# Altium project PCB_Project_PowerLord.PrjPcb
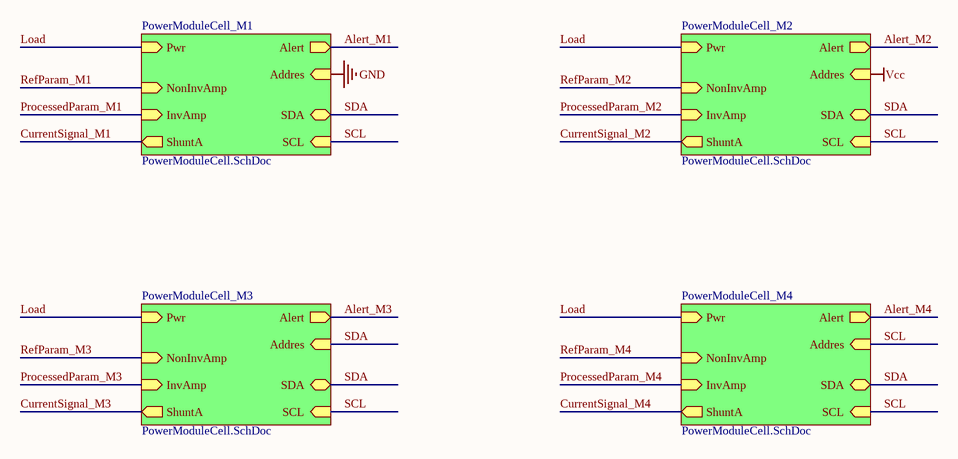
[diagram p0: PowerModule.SchDoc]
5 sheets, 64 parts. Net scope: hierarchical (ports join the sheet entries above them; power ports are global).
Board file: PowerModule.PcbDoc
Sheets:
  PowerModule.SchDoc
    PowerModuleCell_M1 = PowerModuleCell.SchDoc
    PowerModuleCell_M3 = PowerModuleCell.SchDoc
    PowerModuleCell_M2 = PowerModuleCell.SchDoc
    PowerModuleCell_M4 = PowerModuleCell.SchDoc
  MainBoard.SchDoc
    Voltmetr = AutoRange.SchDoc
  UI.SchDoc

## Sheet PowerModule.SchDoc
size A3; SheetNumber: 4; SheetTotal: 10

### Sub-sheets
PowerModuleCell_M1 = PowerModuleCell.SchDoc: Alert (out), Addres (in), SDA (bidir), SCL (in), Pwr (in), NonInvAmp (in), InvAmp (in), ShuntA (out)
PowerModuleCell_M2 = PowerModuleCell.SchDoc: Alert (out), Addres (in), SDA (bidir), SCL (in), Pwr (in), NonInvAmp (in), InvAmp (in), ShuntA (out)
PowerModuleCell_M3 = PowerModuleCell.SchDoc: Alert (out), Addres (in), SDA (bidir), SCL (in), Pwr (in), NonInvAmp (in), InvAmp (in), ShuntA (out)
PowerModuleCell_M4 = PowerModuleCell.SchDoc: Alert (out), Addres (in), SDA (bidir), SCL (in), Pwr (in), NonInvAmp (in), InvAmp (in), ShuntA (out)

### Nets
Alert_M1: sheet PowerModuleCell_M1/Alert
Alert_M2: sheet PowerModuleCell_M2/Alert
Alert_M3: sheet PowerModuleCell_M3/Alert
Alert_M4: sheet PowerModuleCell_M4/Alert
CurrentSignal_M1: sheet PowerModuleCell_M1/ShuntA
CurrentSignal_M2: sheet PowerModuleCell_M2/ShuntA
CurrentSignal_M3: sheet PowerModuleCell_M3/ShuntA
CurrentSignal_M4: sheet PowerModuleCell_M4/ShuntA
Load: sheet PowerModuleCell_M1/Pwr, sheet PowerModuleCell_M3/Pwr, sheet PowerModuleCell_M2/Pwr, sheet PowerModuleCell_M4/Pwr
SCL: sheet PowerModuleCell_M1/SCL, sheet PowerModuleCell_M3/SCL, sheet PowerModuleCell_M2/SCL, sheet PowerModuleCell_M4/Addres, sheet PowerModuleCell_M4/SCL
SDA: sheet PowerModuleCell_M1/SDA, sheet PowerModuleCell_M3/Addres, sheet PowerModuleCell_M3/SDA, sheet PowerModuleCell_M2/SDA, sheet PowerModuleCell_M4/SDA

## Sheet PowerModuleCell.SchDoc
size A4; SheetNumber: 1; SheetTotal: 10
Used 4 times, as channels PowerModuleCell_M1, PowerModuleCell_M3, PowerModuleCell_M2, PowerModuleCell_M4. Parts and nets are listed once, with the designators drawn on the sheet.
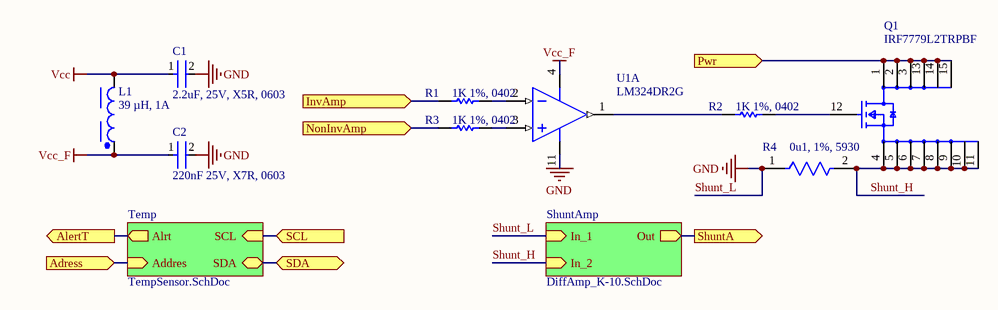
[diagram p1: PowerModuleCell.SchDoc]

### Parts
C1  2.2uF, 25V, X5R, 0603  [FP-GRM188-0_1-e0_2_0_5-MFG]
C2  220nF 25V, X7R, 0603  [FP-GCM188-0_1-IPC_B]
L1  39 µH, 1A  [WE-PD_7345]
Q1  IRF7779L2TRPBF  [FP-MG-WDSON-11-MFG]
R1  1K 1%, 0402  [RESC1005X40X25NL05T05]
R2  1K 1%, 0402  [RESC1005X40X25NL05T05]
R3  1K 1%, 0402  [RESC1005X40X25NL05T05]
R4  0u1, 1%, 5930  [FP-CSS2H-5930K-1L00F-MFG]
U1  LM324DR2G  [ONSC-SOIC-14-751A-03_V]  (part A of 4)

### Sub-sheets
ShuntAmp = DiffAmp_K-10.SchDoc (file not in this document): Out (out), In_2 (in), In_1 (in)
Temp = TempSensor.SchDoc (file not in this document): Alrt (out), SDA (bidir), SCL (in), Addres (in)

### Ports
Adress (in), AlertT (out), InvAmp (in, see PowerModule[3A]), NonInvAmp (in, see PowerModule[3A]), Pwr (in, see PowerModule[3A]), SCL (in, see PowerModule[4A], TempSensor[2A]), SDA (bidir, see PowerModule[4A], TempSensor[2A]), ShuntA (out, see PowerModule[3A])

### Nets
Shunt_L: C1.2 C2.2 R4.1 U1.11(VEE/GND) ; sheet ShuntAmp/In_1  [also labelled GND]
Vcc: C1.1 L1.2
Vcc_F: C2.1 L1.1 U1.4(VCC)
Adress: port Adress, sheet Temp/Addres
AlertT: port AlertT, sheet Temp/Alrt
InvAmp: R1.1 ; port InvAmp
NonInvAmp: R3.1 ; port NonInvAmp
Pwr: Q1.1(Drain) Q1.2(Drain) Q1.3(Drain) Q1.13(Drain) Q1.14(Drain) Q1.15(Drain) ; port Pwr
SCL: port SCL, sheet Temp/SCL
SDA: port SDA, sheet Temp/SDA
Shunt_H: Q1.4(Source) Q1.5(Source) Q1.6(Source) Q1.7(Source) Q1.8(Source) Q1.9(Source) Q1.10(Source) Q1.11(Source) R4.2 ; sheet ShuntAmp/In_2
ShuntA: port ShuntA, sheet ShuntAmp/Out
NetQ1_12: Q1.12(Gate) R2.2
NetR1_2: R1.2 U1.2(IN1-)
NetR2_1: R2.1 U1.1(OUT1)
NetR3_2: R3.2 U1.3(IN1+)

### Channels
PowerModuleCell_M1: designators end in _PowerModuleCell_M1; ports Adress=open AlertT=open InvAmp=ProcessedParam_M1 NonInvAmp=RefParam_M1 Pwr=Load SCL=SCL SDA=SDA ShuntA=CurrentSignal_M1
PowerModuleCell_M3: designators end in _PowerModuleCell_M3; ports Adress=open AlertT=open InvAmp=ProcessedParam_M3 NonInvAmp=RefParam_M3 Pwr=Load SCL=SCL SDA=SDA ShuntA=CurrentSignal_M3
PowerModuleCell_M2: designators end in _PowerModuleCell_M2; ports Adress=open AlertT=open InvAmp=ProcessedParam_M2 NonInvAmp=RefParam_M2 Pwr=Load SCL=SCL SDA=SDA ShuntA=CurrentSignal_M2
PowerModuleCell_M4: designators end in _PowerModuleCell_M4; ports Adress=open AlertT=open InvAmp=ProcessedParam_M4 NonInvAmp=RefParam_M4 Pwr=Load SCL=SCL SDA=SDA ShuntA=CurrentSignal_M4

### Library data of the parts
C1 = CMP-2006-02820-2: Chip Multilayer Ceramic Capacitors for General Purpose, 0603, 2.2uF, X5R, 15%, 10%, 25V; Number of Pins: 2; Dielectric: X5R; Tolerance: 10%; Case Code (Imperial): 0603; Thickness: 0.035inch; Case/Package: 0603; Lead Free: Lead Free; Mount: Surface Mount; Material: Ceramic; Depth: 0.8mm; Voltage: 25V; Capacitance: 2.2uF; Min Operating Temperature: -55°C; Package Quantity: 4000; REACH SVHC: No SVHC; Resistor Type: Ceramic; Packaging: Tape and Reel; Case Code (Metric): 1608; Max Operating Temperature: 85°C; Width: 0.8mm; Termination: SMD/SMT; Voltage Rating: 25V; Length: 1.6mm; Voltage Rating (DC): 25V; Height: 0.8mm; Radiation Hardening: No; Weight: 0.000222oz
C2 = CMP-2006-02366-2: Ceramic Capacitor for Automotive 220nF  ±10% 25VDC X7R 0603 Paper T/R; Capacitance: 220nF; Mount: Surface Mount; Ratings: AEC-Q200; Case/Package: 0603; Packaging: Tape and Reel; Radiation Hardening: No; Voltage: 25V; Dielectric: X7R; Case Code (Imperial): 0603; Max Operating Temperature: 125°C; Min Operating Temperature: -55°C; Depth: 0.8mm; Termination: SMD/SMT; Package Quantity: 1; Case Code (Metric): 1608; Thickness: 0.035inch; Voltage Rating: 25V; Tolerance: 10%; Voltage Rating (DC): 25V; Height: 0.8mm; Lead Free: Lead Free; Length: 1.6mm; Width: 0.031inch
L1 = CMP-0227-00153-2: NexarPartId: 29930417; Max DC Current: 1.11A; Shielding: Shielded; Inductance: 39µH; Self Resonant Frequency: 11MHz; DC Resistance (DCR): 145mΩ; Tolerance: 20%; Ambient Temperature Range Low: -40°C; Width: 7.3mm; Length: 7.3mm; Number of Pins: 2; Packaging: Tape & Reel; Height: 4.5mm; Ambient Temperature Range High: 85°C; Max Operating Temperature: 125°C; Depth: 7.3mm; Min Operating Temperature: -40°C; RoHS: Compliant; Current Rating: 1.11A
Q1 = CMP-32901-000937-1: MOSFET N-CH 150V 375A DIRECTFET; Drain to Source Resistance: 11mR; Power Dissipation: 125W; Turn-On Delay Time: 16ns; Threshold Voltage: 4V; Input Capacitance: 6.66nF; Turn-Off Delay Time: 36ns; Gate to Source Voltage (Vgs): 20V; Length: 0.36inch; Number of Pins: 11; Min Operating Temperature: -55°C; Halogen Free: Halogen Free; Rds On Max: 11mR; REACH SVHC: No SVHC; Max Operating Temperature: 175°C; Continuous Drain Current (ID): 375A; Max Power Dissipation: 125W; Mount: Surface Mount; Width: 0.28inch; Max Dual Supply Voltage: 150V; Lead Free: Lead Free; Height: 0.02inch; Series: HEXFET®; RoHS Compliant: Yes; Drain to Source Voltage (Vdss): 150V; Packaging: Cut Tape
R1-R3 = CMP-1011-00510-4: Chip Resistor, 1 KOhm, +/- 1%, 100 mW, -55 to 155 degC, 0402 (1005 Metric), RoHS, Tape and Reel; PartNumber: ERJ-2RKF1001X; Manufacturer: Basic Passives; Voltage Rating: 50 V; Case\/Package: 0402; Resistance: 1 KOhm; Power Rating: 100 mW; DatasheetVersion: 04/2015; Radiation Hardening: No; Pins: 2; Height: 0.35 mm; RoHSCompliant: true; Case Code (Imperial): 0402; ComponentLink2Description: Datasheet; ComponentLink1Description: Manufacturer URL; PackageReference: 0402; Mount: Surface Mount; Package Quantity: 10000; Tolerance: 1%; ComponentLink1URL: http://www.panasonic.com/; PackageDescription: 2-Pin Surface Mount Device, Body 1 x 0.5 mm; Mounting Technology: Surface Mount; Case Code (Metric): 1005; ComponentLink2URL: http://industrial.panasonic.com/cdbs/www-data/pdf/RDA0000/AOA0000C86.pdf; REACH SVHC: Yes; Packaging: Tape and Reel; Max Operating Temperature: 155 degC; Min Operating Temperature: -55 degC; Width: 0.5 mm; Length: 1 mm
R4 = CMP-00059-73869598-1: CSS2H-5930K-1L00F Res Metal Strip 5930 0.001 Ohm 1% 9W ±50ppm/C Pad SMD Automotive T/R; Resistance: 1mΩ; Temperature Coefficient: 50ppm/°C; Case Code (Imperial): 5931; Width: 7.747mm; Min Operating Temperature: -55°C; Tolerance: 1%; Max Power Dissipation: 9W; Case Code (Metric): 1577; Max Operating Temperature: 170°C; NexarPartId: 73869598; Power Rating: 9W; Composition: Metal Element; Case/Package: 5930; Height: 939.8µm; Number of Terminations: 2; Schedule B: 8533210045, 8533210045; Packaging: Cut Tape; REACH SVHC: No SVHC; Features: Moisture Resistant; RoHS: Compliant; Length: 15.0114mm
U1 = CMP-1310-00171-1: Single Supply Quad Operational Amplifier, 3 to 32 V, 0 to 70 degC, 14-Pin SOIC, Pb-Free, Tape and Reel; Manufacturer: On Semiconductor; VCC Max (V): 32; VCC Min (V): 3; PackageVersion: Rev. K, 05/2011; ComponentLink3URL: http://www.onsemi.com/pub_link/Collateral/751A-03.PDF; ComponentLink3Description: Package Specification; Packing: Tape and Reel; ComponentLink2URL: http://www.onsemi.cn/pub_link/Collateral/LM324-D.PDF; PackageReference: SOIC-14-751A-03; ComponentLink1URL: http://www.onsemi.com/; PackageDescription: 14-Pin Small Outline Integrated Circuit, Body 8.65 x 3.9 mm, Pitch 1.27 mm; ComponentLink1Description: Manufacturer URL; DatasheetVersion: Rev. 25; Mounting Technology: Surface Mount; RoHS: TRUE; ComponentLink2Description: Datasheet; PartNumber: LM324DR2G

## Sheet MainBoard.SchDoc
size A3; SheetNumber: 7; SheetTotal: 11
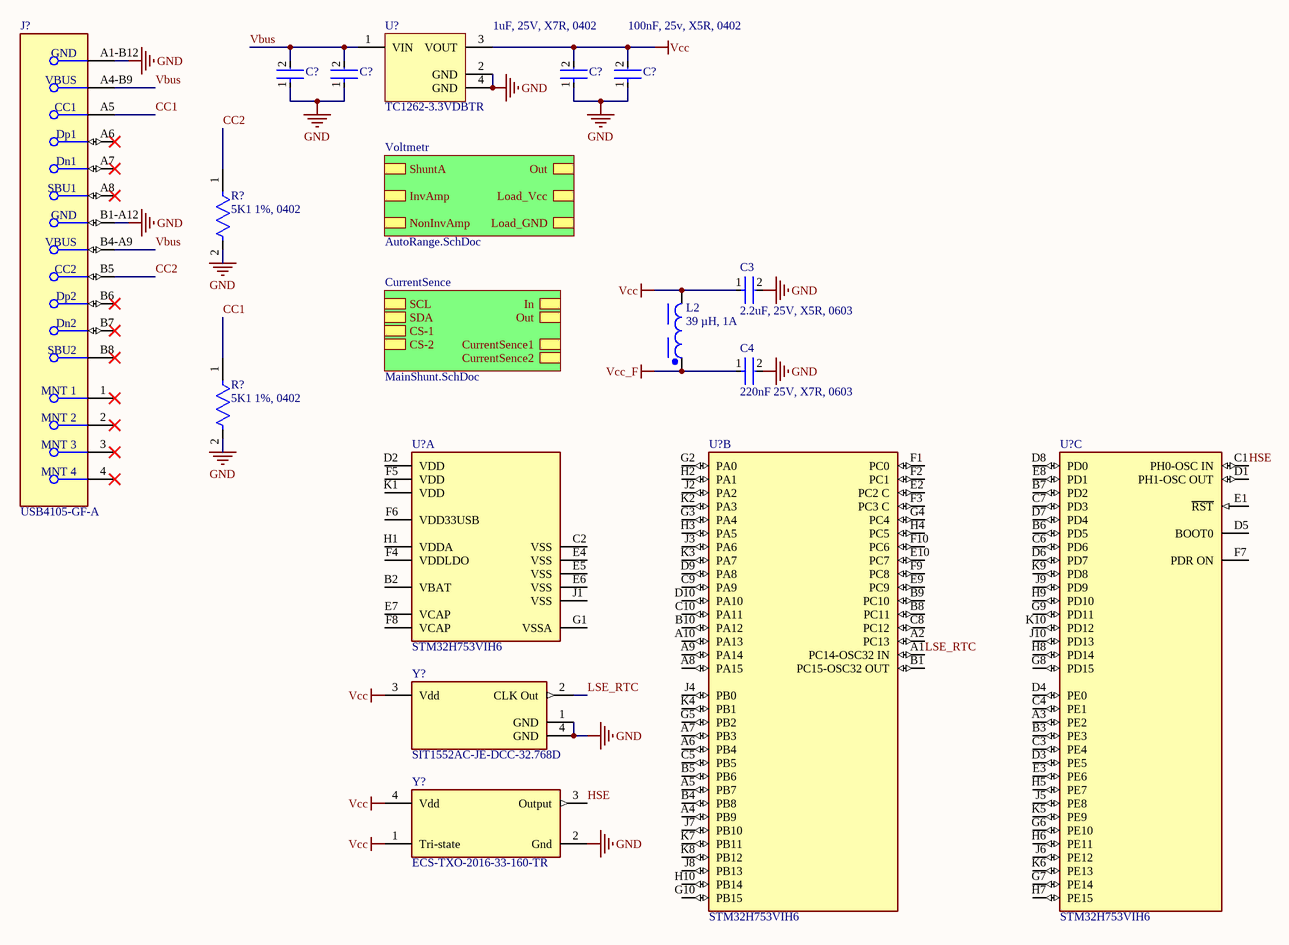
[diagram p2: MainBoard.SchDoc]

### Parts
(Parts that share a designator on the sheet are numbered #1, #2 ... from top to bottom, then left to right.)
C3  2.2uF, 25V, X5R, 0603  [FP-GRM188-0_1-e0_2_0_5-MFG]
C4  220nF 25V, X7R, 0603  [FP-GCM188-0_1-IPC_B]
C?#1  1uF, 25V, X7R, 0402  [FP-GRM155-0_05-IPC_B]  (value not drawn)
C?#2  100nF, 25v, X5R, 0402  [FP-GRM155-0_05-IPC_C]  (value not drawn)
C?#3  100nF, 25v, X5R, 0402  [FP-GRM155-0_05-IPC_C]  (value not drawn)
C?#4  1uF, 25V, X7R, 0402  [FP-GRM155-0_05-IPC_B]  (value not drawn)
J?  USB4105-GF-A  [FP-USB4105-GF-A-MFG]
L2  39 µH, 1A  [WE-PD_7345]
R?#1  5K1 1%, 0402  [FP-ERJ2RK-IPC_A]
R?#2  5K1 1%, 0402  [FP-ERJ2RK-IPC_A]
U?#1  TC1262-3.3VDBTR  [SOT-223-DB3_M]
U?#2  STM32H753VIH6  [FP-TFBGA100-A08Q-MFG]  (part A of 3)
U?#3  STM32H753VIH6  [FP-TFBGA100-A08Q-MFG]  (part B of 3)
U?#4  STM32H753VIH6  [FP-TFBGA100-A08Q-MFG]  (part C of 3)
Y?#1  SIT1552AC-JE-DCC-32.768D  [FP-SiT1552-J-MFG]
Y?#2  ECS-TXO-2016-33-160-TR  [FP-TXO-2016-MFG]

### Sub-sheets
CurrentSence = MainShunt.SchDoc (file not in this document): CurrentSence1, CurrentSence2, CS-1, CS-2, SDA, SCL, In, Out
Voltmetr = AutoRange.SchDoc: InvAmp, NonInvAmp, Load_GND, Load_Vcc, ShuntA, Out

### Nets
GND: C3.2 C4.2 C?#1.1 C?#2.1 C?#3.1 C?#4.1 J?.A1-B12(GND) J?.B1-A12(GND) R?#1.2 R?#2.2 U?#1.2(GND) U?#1.4(GND) Y?#1.1(GND) Y?#1.4(GND) Y?#2.2(Gnd)  [project net Shunt_L]
Vcc: C3.1 C?#3.2 C?#4.2 L2.2 U?#1.3(VOUT) Y?#1.3(Vdd) Y?#2.1(Tri-state) Y?#2.4(Vdd)
Vcc_F: C4.1 L2.1
CC1: J?.A5(CC1) R?#2.1
CC2: J?.B5(CC2) R?#1.1
HSE: U?#4.C1(PH0-OSC_IN) Y?#2.3(Output)
LSE_RTC: U?#3.A1(PC14-OSC32_IN) Y?#1.2(CLK_Out)
Vbus: C?#1.2 C?#2.2 J?.A4-B9(VBUS) J?.B4-A9(VBUS) U?#1.1(VIN)

Not connected (* = marked no-connect by the designer): J? 1(MNT_1)* 2(MNT_2)* 3(MNT_3)* 4(MNT_4)* A6(Dp1)* A7(Dn1)* A8(SBU1)* B6(Dp2)* B7(Dn2)* B8(SBU2)*; U?#2 B2(VBAT) C2(VSS) D2(VDD) E4(VSS) E5(VSS) E6(VSS) E7(VCAP) F4(VDDLDO) F5(VDD) F6(VDD33USB) F8(VCAP) G1(VSSA) H1(VDDA) J1(VSS) K1(VDD); U?#3 A2(PC13) A4(PB9) A5(PB7) A6(PB4) A7(PB3) A8(PA15) A9(PA14) A10(PA13) B1(PC15-OSC32_OUT) B4(PB8) B5(PB6) B8(PC11) B9(PC10) B10(PA12) C5(PB5) C8(PC12) C9(PA9) C10(PA11) D9(PA8) D10(PA10) E2(PC2_C) E9(PC9) E10(PC7) F1(PC0) F2(PC1) F3(PC3_C) F9(PC8) F10(PC6) G2(PA0) G3(PA4) G4(PC4) G5(PB2) G10(PB15) H2(PA1) H3(PA5) H4(PC5) H10(PB14) J2(PA2) J3(PA6) J4(PB0) J7(PB10) J8(PB13) K2(PA3) K3(PA7) K4(PB1) K7(PB11) K8(PB12); U?#4 A3(PE2) B3(PE3) B6(PD5) B7(PD2) C3(PE4) C4(PE1) C6(PD6) C7(PD3) D1(PH1-OSC_OUT) D3(PE5) D4(PE0) D5(BOOT0) D6(PD7) D7(PD4) D8(PD0) E1(~{RST}) E3(PE6) E8(PD1) F7(PDR_ON) G6(PE10) G7(PE14) G8(PD15) G9(PD11) H5(PE7) H6(PE11) H7(PE15) H8(PD14) H9(PD10) J5(PE8) J6(PE12) J9(PD9) J10(PD13) K5(PE9) K6(PE13) K9(PD8) K10(PD12)

### Notes on the sheet
- 1uF, 25V, X7R, 0402
- (near C?#4) 100nF, 25v, X5R, 0402

### Library data of the parts
C3 = CMP-2006-02820-2: as C1 on sheet PowerModuleCell; Number of Pins: 2; Dielectric: X5R; Tolerance: 10%; Case Code (Imperial): 0603; Thickness: 0.035inch; Case/Package: 0603; Lead Free: Lead Free; Mount: Surface Mount; Material: Ceramic; Depth: 0.8mm; Voltage: 25V; Capacitance: 2.2uF; Min Operating Temperature: -55°C; Package Quantity: 4000; REACH SVHC: No SVHC; Resistor Type: Ceramic; Packaging: Tape and Reel; Case Code (Metric): 1608; Max Operating Temperature: 85°C; Width: 0.8mm; Termination: SMD/SMT; Voltage Rating: 25V; Length: 1.6mm; Voltage Rating (DC): 25V; Height: 0.8mm; Radiation Hardening: No; Weight: 0.000222oz
C4 = CMP-2006-02366-2: as C2 on sheet PowerModuleCell; Capacitance: 220nF; Mount: Surface Mount; Ratings: AEC-Q200; Case/Package: 0603; Packaging: Tape and Reel; Radiation Hardening: No; Voltage: 25V; Dielectric: X7R; Case Code (Imperial): 0603; Max Operating Temperature: 125°C; Min Operating Temperature: -55°C; Depth: 0.8mm; Termination: SMD/SMT; Package Quantity: 1; Case Code (Metric): 1608; Thickness: 0.035inch; Voltage Rating: 25V; Tolerance: 10%; Voltage Rating (DC): 25V; Height: 0.8mm; Lead Free: Lead Free; Length: 1.6mm; Width: 0.031inch
C?#1 C?#4 = CMP-2008-04581-2: Chip Multilayer Ceramic Capacitors for General Purpose, 0402, 1.0uF, X5R, 15%, 10%, 25V; Height: 0.5mm; Voltage: 25V; Tolerance: 10%; Termination: SMD/SMT; Dielectric: X5R; REACH SVHC: No SVHC; Case Code (Imperial): 0402; Max Operating Temperature: 85°C; Lead Free: Lead Free; Case/Package: 0402; Mount: Surface Mount; Width: 0.5mm; Weight: 0.000212oz; Min Operating Temperature: -55°C; Voltage Rating (DC): 25V; Length: 1mm; Thickness: 0.022inch; Voltage Rating: 25V; Material: Ceramic; Case Code (Metric): 1005; Package Quantity: 10000; Packaging: Tape and Reel; Depth: 0.5mm; Capacitance: 1uF
C?#2 C?#3 = CMP-06035-003661-1: Chip Multilayer Ceramic Capacitors for General Purpose, 0402, 0.10uF, X7R, 15%, 10%, 25V; Length: 1mm; Depth: 0.5mm; Dielectric: X7R; Voltage Rating: 25V; Lead Free: Lead Free; Case Code (Imperial): 0402; Voltage: 25V; Min Operating Temperature: -55°C; Tolerance: 10%; Dielectric Material: Ceramic; Voltage Rating (DC): 25V; Max Operating Temperature: 125°C; Capacitance: 100nF; Thickness: 0.022inch; Case/Package: 0402; Height: 0.5mm; Resistor Type: Ceramic; Weight: 0.000212oz; Case Code (Metric): 1005; Package Quantity: 10000; Termination: SMD/SMT; Width: 0.02inch; Mount: Surface Mount; Packaging: Tape and Reel
J? = CMP-245163-000001-1: CONN RCPT USB2.0 TYPEC 5A; Manufacturer: GCT; Voltage Rating: 20V; Is Female: yes; Current Rating: 5/6.25/1.25/0.25A; Number Of Contacts: 16; Conn Orientation: Right Angle; Device Class L1: Connectors; Category: Conn; Lead Free: Yes; RoHS: TRUE; Temperature Range High: +85°C; Digikey Description: CONN RCPT USB2.0 TYPEC 5A; Device Class L3: unset; ComponentLink2Description: Datasheet; Manufacturer Part Number: USB4105-GF-A; Package: 0; Usb Standard: USB 2.0; Device Class L2: USB Connectors; Automotive: No; Temperature Range Low: -40°C; Height: 3.46mm; Temperature: -40°C to +85°C; Contact Material: Gold,Nickel; ComponentLink2URL: https://gct.co/files/drawings/usb4105.pdf; Octopart: https://octopart.com/usb4105-gf-a-gct-106627878
L2 = CMP-0227-00153-2: as L1 on sheet PowerModuleCell; Ambient Temperature Range Low: -40°C; Width: 7.3mm; Length: 7.3mm; Number of Pins: 2; Packaging: Tape & Reel; Height: 4.5mm; Ambient Temperature Range High: 85°C; Max Operating Temperature: 125°C; Depth: 7.3mm; Min Operating Temperature: -40°C; RoHS: Compliant; Current Rating: 1.11A
R?#1 R?#2 = CMP-2002-01158-2: RES SMD 5.1K OHM 1% 1/10W 0402; Voltage Rating: 50V; Temperature Coefficient: 100ppm/°C; Resistance: 5.1kR; Power Rating: 100mW; Min Operating Temperature: -55°C; Technology: THICK FILM; Military Standard: Not; Depth: 0.5mm; Contact Plating: Tin; Tolerance: 1%; Construction: Rectangular; Length: 1mm; Case/Package: 0402; Lead Free: Lead Free; RoHS Compliant: Yes; Termination: SMD/SMT; Height: 0.35mm; Max Operating Temperature: 155°C; Case Code (Imperial): 0402; Number of Terminations: 2; Packaging: Tape and Reel; Case Code (Metric): 1005; Width: 0.5mm; Max Power Dissipation: 100mW; Package Quantity: 10000; Resistance Tolerance: 1%; REACH SVHC: No SVHC; Mount: Surface Mount; Series: ERJ; Voltage Rating (DC): 50V; Weight: 2.8E-05oz; Resistor Type: Thick Film
U?#1 = CMP-0136-00481-1: 500mA Fixed Output CMOS LDO, 3-Pin SOT-223, Extended Temperature, Tape and Reel; PackageVersion: revBB, Aug-2009; PackageDescription: 3-Lead Plastic Small Outline Transistor (DB) [SOT-223]; DatasheetVersion: revB, 2002; PackageReference: SOT-223-DB3
U?#2-U?#4 = CMP-12105-000002-1: HIGH-PERFORMANCE AND DSP WITH DP; Manufacturer: STMicroelectronics; Number Of Timers/Counters: 20; Min Supply Voltage: 1.71V; Standoff Height: 0.15mm; Number Of I/Os: 82; Data Bus Width: 32bits; Interface: I2C,SPI,UART,USART,CAN,USB,Ethernet,I2S,SMBus,Other; Description: ARM® Cortex®-M7 STM32H7 Microcontroller IC 32-Bit 480MHz 2MB (2M x 8) FLASH 100-TFBGA (8x8); Memory Size: 2MBytes; Core Architecture: ARM Cortex-M7; Frequency: 480MHz; Number Of Spi Channels: 6; Memory Type: FLASH; Max Junction Temp: +125°C; Number Of Pwm Channels: 2; Nominal Supply Current: 70-165uA; Number Of A/D Converters: 3; Ram Size: 1MBytes; Number Of I2C Channels: 4; Number Of Adc Channels: 36; Max Supply Voltage: 3.6V; Number Of Cores: 1; Number Of Uart Channels: 9; Automotive: No; Lead Free: Yes; Device Class L3: Microcontrollers; ComponentLink2URL: https://www.st.com/resource/en/datasheet/stm32h753ai.pdf; Temperature: -40°C to +85°C; Device Class L1: Integrated Circuits (ICs); Digikey Description: HIGH-PERFORMANCE AND DSP WITH DP; Ipc Land Pattern Name: BGA100C80P10X10_800X800X110; ComponentLink2Description: Datasheet; Ambient Temperature Range Low: -40°C; Category: IC; Height: 1.1mm; Temperature Range High: +85°C; Ambient Temperature Range High: +85°C; Temperature Range Low: -40°C; Number Of Usb Channels: 2; Manufacturer Part Number: STM32H753VIH6; Octopart: https://octopart.com/stm32h753vih6-stmicroelectronics-93180202; Package: TFBGA100-A08Q; Number Of Ethernet Channels: 1; Device Class L2: Embedded Processors and Controllers; RoHS: TRUE
Y?#1 = CMP-25159-260295-1: MEMS OSC TCXO 32.7680KHZ LVCMOS; Frequency Stability: 5ppm; Frequency: 32.768kHz; Min Operating Temperature: 0°C; Length: 0.061inch; Mount: Surface Mount; Max Operating Temperature: 70°C; Width: 0.033inch; RoHS Compliant: Yes; Series: SiT1552; Packaging: Cut Tape; Height: 0.024inch
Y?#2 = CMP-40224-000008-1: XTAL OSC TCXO 16MHZ 3.3V SMD; Manufacturer: ECS; Max Supply Voltage: 3.63V; Max Supply Current: 7mA; Stability: 2ppm; Min Supply Voltage: 2.97V; Description: 16MHz TCXO HCMOS Oscillator 3.3V Enable/Disable 4-SMD, No Lead; Load Capacitance: 15pF; Frequency: 16MHz; Device Class L1: Passive Components; Manufacturer Part Number: ECS-TXO-2016-33-160-TR; Digikey Description: XTAL OSC TCXO 16MHZ 3.3V SMD; Device Class L3: Oscillators; Category: Crys; Lead Free: Yes; Temperature: -40°C to +85°C; RoHS: TRUE; ComponentLink2Description: Datasheet; Octopart: https://octopart.com/ecs-txo-2016-33-160-tr-ecs+international-102811109; ComponentLink2URL: https://ecsxtal.com/store/pdf/ECS-TXO-2016.pdf; Temperature Range High: +85°C; Height: 0.8mm; Device Class L2: Crystals / Oscillators; Package: TXO-2016; Temperature Range Low: -40°C; Series: TXO-2016; Automotive: No

## Sheet AutoRange.SchDoc
size A4; SheetNumber: 10; SheetTotal: 10
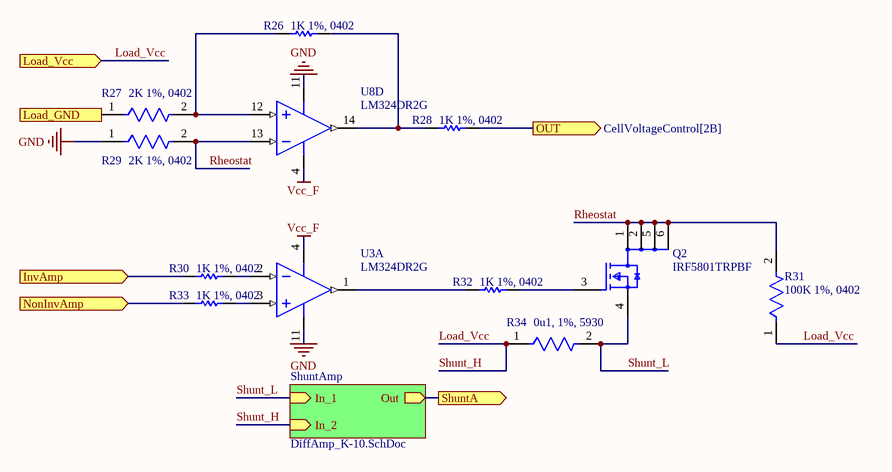
[diagram p3: AutoRange.SchDoc]

### Parts
Q2  IRF5801TRPBF  [FP-PG-TSOP-6-MFG]
R26  1K 1%, 0402  [RESC1005X40X25NL05T05]
R27  2K 1%, 0402  [FP-ERJ2RK-MFG]
R28  1K 1%, 0402  [RESC1005X40X25NL05T05]
R29  2K 1%, 0402  [FP-ERJ2RK-MFG]
R30  1K 1%, 0402  [RESC1005X40X25NL05T05]
R31  100K 1%, 0402  [FP-ERJ2RK-IPC_C]
R32  1K 1%, 0402  [RESC1005X40X25NL05T05]
R33  1K 1%, 0402  [RESC1005X40X25NL05T05]
R34  0u1, 1%, 5930  [FP-CSS2H-5930K-1L00F-MFG]
U3  LM324DR2G  [ONSC-SOIC-14-751A-03_V]  (part A of 4)
U8  LM324DR2G  [ONSC-SOIC-14-751A-03_V]  (part D of 4)

### Sub-sheets
ShuntAmp = DiffAmp_K-10.SchDoc (file not in this document): Out (out), In_2 (in), In_1 (in)

### Ports
InvAmp (in, see PowerModule[3A]), Load_GND (in, see PowerModule[3A]), Load_Vcc (in, see PowerModule[3A]), NonInvAmp (in, see PowerModule[3A]), OUT (out, see CellVoltageControl[2B]), ShuntA (out, see PowerModule[3A])

### Nets
GND: R29.1 U3.11(VEE/GND) U8.11(VEE/GND)  [project net Shunt_L]
Vcc_F: U3.4(VCC) U8.4(VCC)
Load_Vcc: R31.1 R34.1 ; port Load_Vcc, sheet ShuntAmp/In_2  [also labelled Shunt_H]
Rheostat: Q2.1(D) Q2.2(D) Q2.5(D) Q2.6(D) R29.2 R31.2 U8.13(IN4-)
Shunt_L: Q2.4(S) R34.2 ; sheet ShuntAmp/In_1
NetQ2_3: Q2.3(G) R32.2
NetR26_1: R26.1 R27.2 U8.12(IN4+)
NetR26_2: R26.2 R28.1 U8.14(OUT4)
NetR27_1: R27.1 ; port Load_GND
NetR28_2: R28.2 ; port OUT
NetR30_1: R30.1 ; port InvAmp
NetR30_2: R30.2 U3.2(IN1-)
NetR32_1: R32.1 U3.1(OUT1)
NetR33_1: R33.1 ; port NonInvAmp
NetR33_2: R33.2 U3.3(IN1+)
(unnamed): port ShuntA, sheet ShuntAmp/Out

### Library data of the parts
Q2 = CMP-32901-001111-1: MOSFET N-CH 200V 600MA MICRO6; Turn-On Delay Time: 6.5ns; Power Dissipation: 2W; Rds On Max: 2.2R; Polarization: N; Input Capacitance: 88pF; Turn-Off Delay Time: 8.8ns; Threshold Voltage: 5.5V; Gate to Source Voltage (Vgs): 30V; Max Dual Supply Voltage: 200V; Mount: Surface Mount; Width: 0.067inch; RoHS Compliant: Yes; Series: HEXFET®; Packaging: Cut Tape; Drain to Source Breakdown Voltage: 200V; Length: 0.118inch; Height: 0.039inch; Number of Pins: 6; Case/Package: TSOP; Halogen Free: Halogen Free; Drain to Source Voltage (Vdss): 200V; Min Operating Temperature: -55°C; Reach SVHC Compliant: Yes; Max Operating Temperature: 150°C; Lead Free: Lead Free; Max Power Dissipation: 2W; Continuous Drain Current (ID): 600mA; Drain to Source Resistance: 2.2R
R26 R28 R30 R32 R33 = CMP-1011-00510-4: as R1 on sheet PowerModuleCell; DatasheetVersion: 04/2015; Radiation Hardening: No; Pins: 2; Height: 0.35 mm; RoHSCompliant: true; Case Code (Imperial): 0402; ComponentLink2Description: Datasheet; ComponentLink1Description: Manufacturer URL; PackageReference: 0402; Mount: Surface Mount; Package Quantity: 10000; Tolerance: 1%; ComponentLink1URL: http://www.panasonic.com/; PackageDescription: 2-Pin Surface Mount Device, Body 1 x 0.5 mm; Mounting Technology: Surface Mount; Case Code (Metric): 1005; ComponentLink2URL: http://industrial.panasonic.com/cdbs/www-data/pdf/RDA0000/AOA0000C86.pdf; REACH SVHC: Yes; Packaging: Tape and Reel; Max Operating Temperature: 155 degC; Min Operating Temperature: -55 degC; Width: 0.5 mm; Length: 1 mm
R27 R29 = CMP-2002-00758-4: RES SMD 2K OHM 1% 1/10W 0402; Temperature Coefficient: 100ppm/°C; Max Power Dissipation: 100mW; Working Voltage: 50V; Resistance: 2kR; Number of Terminations: 2; Technology: THICK FILM; Packaging: Tape and Reel; RoHS Compliant: Yes; Min Operating Temperature: -55°C; Length: 1mm; Construction: Rectangular; Features: Automotive AEC-Q200; Contact Plating: Tin; Lead Free: Lead Free; Series: ERJ; Power Rating: 100mW; REACH SVHC: No SVHC; Resistor Type: Thick Film; Max Operating Temperature: 155°C; Package Quantity: 10000; Height: 0.35mm; Case/Package: 0402; Tolerance: 1%; Mount: Surface Mount; Termination: SMD/SMT; Resistance Tolerance: 1%; Depth: 0.5mm; Voltage Rating (DC): 50V; Voltage Rating: 50V; Case Code (Imperial): 0402; Military Standard: Not; Width: 0.02inch; Radiation Hardening: No; Case Code (Metric): 1005
R31 = CMP-2002-00608-4: RES SMD 100K OHM 1% 1/10W 0402; Resistance: 100kR; Voltage Rating (DC): 50V; Power Rating: 100mW; Temperature Coefficient: 100ppm/°C; Case/Package: 0402; Length: 1mm; Package Quantity: 1; Radiation Hardening: No; Case Code (Metric): 1005; Contact Plating: Tin; Mount: Surface Mount; Depth: 0.5mm; Max Operating Temperature: 155°C; Lead Free: Lead Free; Width: 0.5mm; Composition: Thick Film; Case Code (Imperial): 0402; Tolerance: 1%; Termination: SMD/SMT; Number of Pins: 2; Height: 0.35mm; Voltage Rating: 50V; Military Standard: Not; REACH SVHC: No SVHC; Packaging: Tape and Reel; Min Operating Temperature: -55°C; Max Power Dissipation: 100mW; Features: Automotive AEC-Q200; Number of Terminations: 2
R34 = CMP-00059-73869598-1: as R4 on sheet PowerModuleCell; Case Code (Imperial): 5931; Width: 7.747mm; Min Operating Temperature: -55°C; Tolerance: 1%; Max Power Dissipation: 9W; Case Code (Metric): 1577; Max Operating Temperature: 170°C; NexarPartId: 73869598; Power Rating: 9W; Composition: Metal Element; Case/Package: 5930; Height: 939.8µm; Number of Terminations: 2; Schedule B: 8533210045, 8533210045; Packaging: Cut Tape; REACH SVHC: No SVHC; Features: Moisture Resistant; RoHS: Compliant; Length: 15.0114mm
U3 U8 = CMP-1310-00171-1: as U1 on sheet PowerModuleCell; PackageVersion: Rev. K, 05/2011; ComponentLink3URL: http://www.onsemi.com/pub_link/Collateral/751A-03.PDF; ComponentLink3Description: Package Specification; Packing: Tape and Reel; ComponentLink2URL: http://www.onsemi.cn/pub_link/Collateral/LM324-D.PDF; PackageReference: SOIC-14-751A-03; ComponentLink1URL: http://www.onsemi.com/; PackageDescription: 14-Pin Small Outline Integrated Circuit, Body 8.65 x 3.9 mm, Pitch 1.27 mm; ComponentLink1Description: Manufacturer URL; DatasheetVersion: Rev. 25; Mounting Technology: Surface Mount; RoHS: TRUE; ComponentLink2Description: Datasheet; PartNumber: LM324DR2G

## Sheet UI.SchDoc
size A3; SheetNumber: 8; SheetTotal: 8

## Nets that join several sheets
Shunt_L: PowerModuleCell_M1 (C1_PowerModuleCell_M1.2 C2_PowerModuleCell_M1.2 R4_PowerModuleCell_M1.1 U1_PowerModuleCell_M1.11), PowerModuleCell_M3 (C1_PowerModuleCell_M3.2 C2_PowerModuleCell_M3.2 R4_PowerModuleCell_M3.1 U1_PowerModuleCell_M3.11), PowerModuleCell_M2 (C1_PowerModuleCell_M2.2 C2_PowerModuleCell_M2.2 R4_PowerModuleCell_M2.1 U1_PowerModuleCell_M2.11), PowerModuleCell_M4 (C1_PowerModuleCell_M4.2 C2_PowerModuleCell_M4.2 R4_PowerModuleCell_M4.1 U1_PowerModuleCell_M4.11), MainBoard (15 pins), AutoRange (R29.1 U3.11 U8.11)
Vcc: PowerModuleCell_M1 (C1_PowerModuleCell_M1.1 L1_PowerModuleCell_M1.2), PowerModuleCell_M3 (C1_PowerModuleCell_M3.1 L1_PowerModuleCell_M3.2), PowerModuleCell_M2 (C1_PowerModuleCell_M2.1 L1_PowerModuleCell_M2.2), PowerModuleCell_M4 (C1_PowerModuleCell_M4.1 L1_PowerModuleCell_M4.2), MainBoard (8 pins)
Vcc_F: PowerModuleCell_M1 (C2_PowerModuleCell_M1.1 L1_PowerModuleCell_M1.1 U1_PowerModuleCell_M1.4), PowerModuleCell_M3 (C2_PowerModuleCell_M3.1 L1_PowerModuleCell_M3.1 U1_PowerModuleCell_M3.4), PowerModuleCell_M2 (C2_PowerModuleCell_M2.1 L1_PowerModuleCell_M2.1 U1_PowerModuleCell_M2.4), PowerModuleCell_M4 (C2_PowerModuleCell_M4.1 L1_PowerModuleCell_M4.1 U1_PowerModuleCell_M4.4), MainBoard (C4.1 L2.1), AutoRange (U3.4 U8.4)
Load: PowerModuleCell_M1 (6 pins), PowerModuleCell_M3 (6 pins), PowerModuleCell_M2 (6 pins), PowerModuleCell_M4 (6 pins)